# Altium schematic sheet Schematic_Rev1.SchDoc
size A4; SheetNumber: 1; SheetTotal: 1
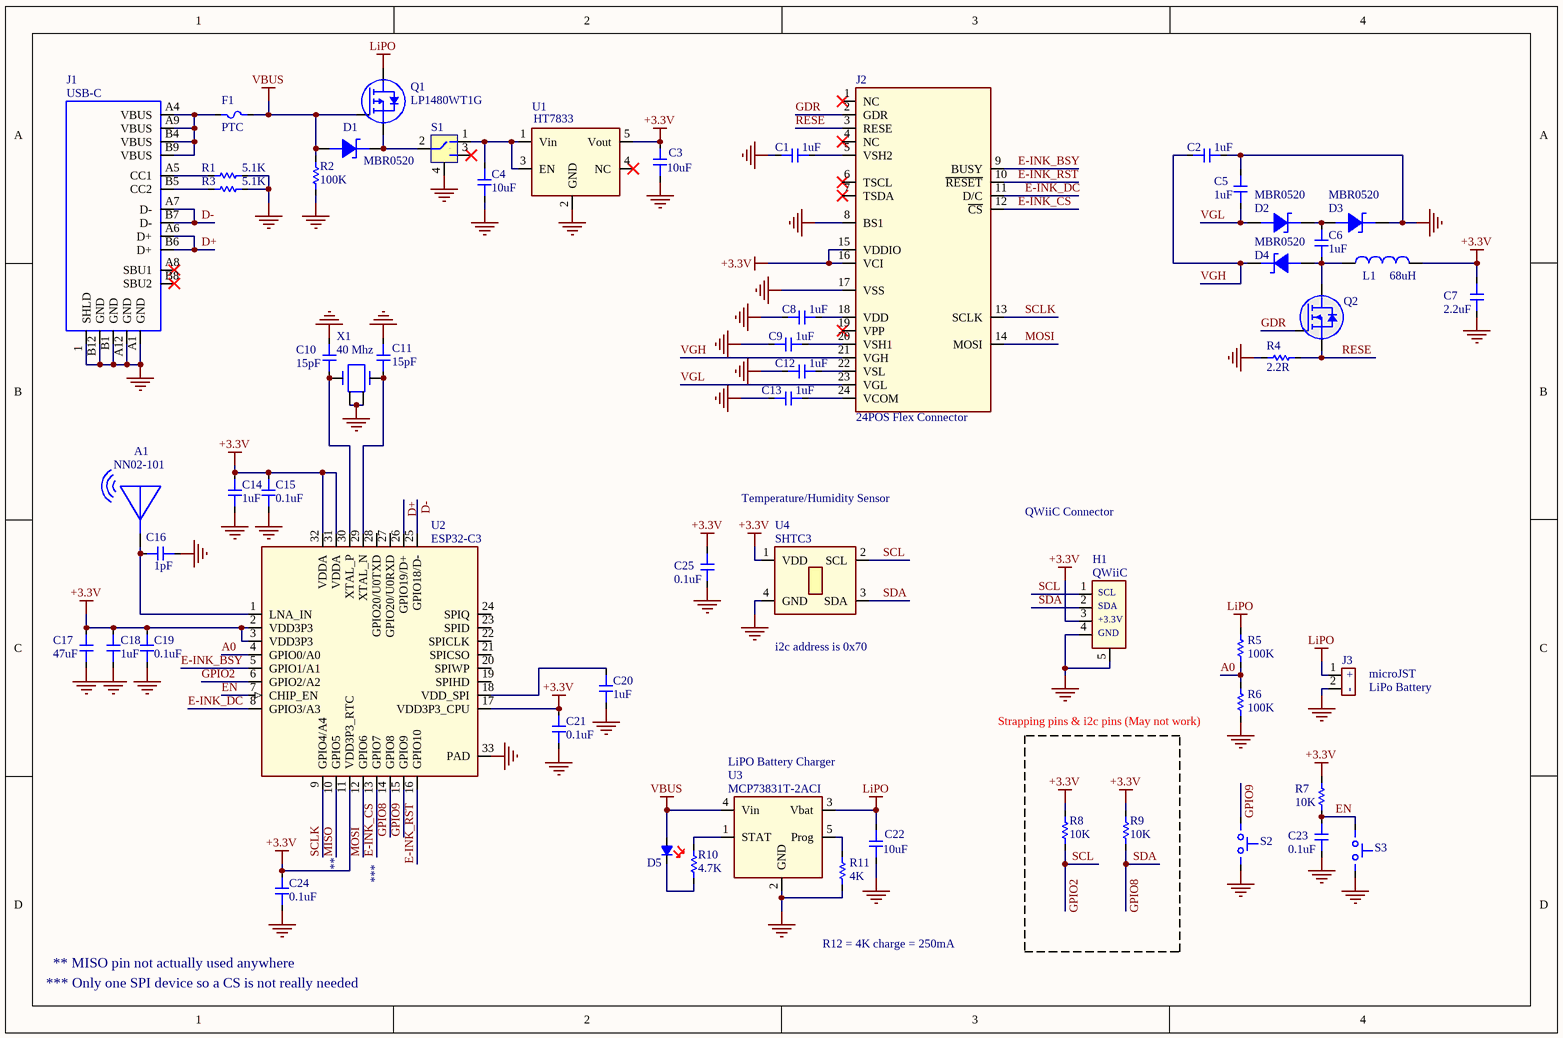
[diagram p0: Schematic_Rev1.SchDoc]

## Parts
A1  NN02-101  [NN02-101]
C1  1uF  [CAPC1005X56N]
C2  1uF  [CAPC1005X56N]
C3  10uF  [CAPC2012X140N]
C4  10uF  [CAPC2012X140N]
C5  1uF  [CAPC1005X56N]
C6  1uF  [CAPC1005X56N]
C7  2.2uF  [CAPC1608X09L]
C8  1uF  [CAPC1005X56N]
C9  1uF  [CAPC1005X56N]
C10  15pF  [CAPC1005X56N]
C11  15pF  [CAPC1005X56N]
C12  1uF  [CAPC1005X56N]
C13  1uF  [CAPC1005X56N]
C14  1uF  [CAPC1005X56N]
C15  0.1uF  [CAPC1005X56N]
C16  1pF  [CAPC1005X56N]
C17  47uF  [CAPC3225X160N]
C18  1uF  [CAPC1005X56N]
C19  0.1uF  [CAPC1005X56N]
C20  1uF  [CAPC1005X56N]
C21  0.1uF  [CAPC1005X56N]
C22  10uF  [CAPC2012X140N]
C23  0.1uF  [CAPC1005X56N]
C24  0.1uF  [CAPC1005X56N]
C25  0.1uF  [CAPC1005X56N]
D1  MBR0520  [SOD123]
D2  value MBR0520  [SOD123]  (hidden comment: MBR0520-TP)
D3  value MBR0520  [SOD123]  (hidden comment: MBR0520-TP)
D4  value MBR0520  [SOD123]  (hidden comment: MBR0520-TP)
D5  Red Led  [LED1005X40N-Red]  (value not drawn)
F1  TLC-PSMD050  [PTC2012X70L]  (value not drawn)
H1  QWiiC  [SM04B-SRSS-TB]
J1  USB-C  [TYPE-C-31-M-12]
J2  24POS Flex Connector  [687124182122]
J3  CON2  [JST_Micro_2PIN]  (value not drawn)  (no BOM)
L1  68uH  [INDUCTOR, 4mmX4mm]
Q1  LP1480WT1G  [SC-70]
Q2  (no value)  [SOT95P240X110-3N]
R1  5.1K  [RESC1005X40L (0402 FOOTPRINT)]
R2  100K  [RESC1005X40L (0402 FOOTPRINT)]
R3  5.1K  [RESC1005X40L (0402 FOOTPRINT)]
R4  2.2R  [RESC1005X40L (0402 FOOTPRINT)]
R5  100K  [RESC1005X40L (0402 FOOTPRINT)]
R6  100K  [RESC1005X40L (0402 FOOTPRINT)]
R7  10K  [RESC1005X40L (0402 FOOTPRINT)]
R8  10K  [RESC1005X40L (0402 FOOTPRINT)]
R9  10K  [RESC1005X40L (0402 FOOTPRINT)]
R10  4.7K  [RESC1005X40L (0402 FOOTPRINT)]
R11  4K  [RESC1005X40L (0402 FOOTPRINT)]
S1  SWITCH SLIDE  [K3-1296S-E1]  (value not drawn)
S2  (no value)  [TS-1088R-02526]
S3  (no value)  [TS-1088R-02526]
U1  HT7833  [SOT95P280X144-5N]
U2  ESP32-C3  [VFQFN-32 -ESP32-C3]
U3  value MCP73831T-2ACI  [SOT95P280X144-5N]  (hidden comment: MCP73831T-2ACI/OT)
U4  SHTC3  [DFN-4 (2.0mm X 2.0mm)]
X1  40 Mhz  [OSC20X16]

## Nets
+3.3V: C3.1 C7.1 C14.1 C15.1 C17.1 C18.1 C19.1 C21.1 C24.1 C25.1 H1.3 J2.15(VDDIO) J2.16(VCI) L1.2 R7.1 R8.2 R9.2 U1.5(Vout) U2.2(VDD3P3) U2.3(VDD3P3) U2.11(VDD3P3_RTC) U2.17(VDD3P3_CPU) U2.31(VDDA) U2.32(VDDA) U4.1(VDD)
GND: C1.1 C2.2 C3.2 C4.2 C5.1 C7.2 C8.1 C9.1 C10.1 C11.1 C12.1 C13.1 C14.2 C15.2 C16.2 C17.2 C18.2 C19.2 C20.2 C21.2 C22.2 C23.2 C24.2 C25.2 D3.1(Cathode) H1.4 H1.5 J1.1(SHLD) J1.A1(GND) J1.A12(GND) J1.B1(GND) J1.B12(GND) J2.8(BS1) J2.17(VSS) J3.2 R1.1 R2.2 R3.1 R4.2 R6.1 R11.1 S1.4 S2.2(B) S3.2(B) U1.2(GND) U2.33(PAD) U3.2(GND) U4.4(GND) X1.2 X1.4
LiPO: C22.1 J3.1 Q1.3(D) R5.2 U3.3(Vbat)
VBUS: D1.2(Annode) D5.2 F1.1 Q1.1(G) R2.1 U3.4(Vin)
A0: R5.1 R6.2 U2.4(GPIO0/A0)
D+: J1.A6(D+) J1.B6(D+) U2.26(GPIO19/D+)
D-: J1.A7(D-) J1.B7(D-) U2.25(GPIO18/D-)
E-INK_BSY: J2.9(BUSY) U2.5(GPIO1/A1)
E-INK_CS: J2.12(~{CS}) U2.13(GPIO7)
E-INK_DC: J2.11(D/C) U2.8(GPIO3/A3)
E-INK_RST: J2.10(~{RESET}) U2.16(GPIO10)
EN: C23.1 R7.2 S3.1(A) U2.7(CHIP_EN)
GDR: J2.2(GDR) Q2.1(G)
GPIO2: H1.1 R8.1 U2.6(GPIO2/A2) U4.2(SCL)  [also labelled SCL]
GPIO8: H1.2 R9.1 U2.14(GPIO8) U4.3(SDA)  [also labelled SDA]
GPIO9: S2.1(A) U2.15(GPIO9)
MISO: U2.10(GPIO5)
MOSI: J2.14(MOSI) U2.12(GPIO6)
RESE: J2.3(RESE) Q2.2(S) R4.1
SCLK: J2.13(SCLK) U2.9(GPIO4/A4)
VGH: C2.1 D4.1(Cathode) J2.21(VGH)
VGL: C5.2 D2.2(Annode) J2.23(VGL)
NetA1_1: A1.1 C16.1 U2.1(LNA_IN)
NetC1_2: C1.2 J2.5(VSH2)
NetC4_1: C4.1 S1.1 U1.1(Vin) U1.3(EN)
NetC6_1: C6.1 D2.1(Cathode) D3.2(Annode)
NetC6_2: C6.2 D4.2(Annode) L1.1 Q2.3(D)
NetC8_2: C8.2 J2.18(VDD)
NetC9_2: C9.2 J2.20(VSH1)
NetC10_2: C10.2 U2.30(XTAL_P) X1.1
NetC11_2: C11.2 U2.29(XTAL_N) X1.3
NetC12_2: C12.2 J2.22(VSL)
NetC13_2: C13.2 J2.24(VCOM)
NetC20_1: C20.1 U2.18(VDD_SPI)
NetD1_1: D1.1(Cathode) Q1.2(S) S1.2
NetD5_1: D5.1 R10.1
NetF1_2: F1.2 J1.A4(VBUS) J1.A9(VBUS) J1.B4(VBUS) J1.B9(VBUS)
NetJ1_A5: J1.A5(CC1) R1.2
NetJ1_B5: J1.B5(CC2) R3.2
NetR10_2: R10.2 U3.1(STAT)
NetR11_2: R11.2 U3.5(Prog)

Not connected (* = marked no-connect by the designer): J1 A8(SBU1)* B8(SBU2)*; J2 1(NC)* 4(NC)* 6(TSCL)* 7(TSDA)* 19(VPP)*; S1 3*; U1 4(NC)*; U2 19(SPIHD) 20(SPIWP) 21(SPICSO) 22(SPICLK) 23(SPID) 24(SPIQ) 27(GPIO20/U0RXD) 28(GPIO20/U0TXD)

## Notes on the sheet
- (near F1) PTC
- Temperature/Humidity Sensor
- QWiiC Connector
- (near U4) i2c address is 0x70
- (near J3) LiPo Battery
- (near J3) microJST
- (near U3) LiPO Battery Charger
- (near R6) Strapping pins & i2c pins (May not work)
- (near C24) **
- ***
- *** Only one SPI device so a CS is not really needed
- (near C24) ** MISO pin not actually used anywhere
- R12 = 4K charge = 250mA
- (in symbol JST_Micro_CONN_2PIN) +; -
- (in symbol SM04B-SRSS-TB) SCL; SDA; +3.3V; GND

## Library data of the parts
A1 = NN02-101: Antenna Chip 2.4Gig; Manufacturer: Ignion; Vendor: Digi-Key; Value: Chip Antenna; Part_Number: NN02-101
C1 C2 C5 C6 C8 C9 C12-C14 C18 C20 = CAP_0402: CAP 1uF 0402; Part_Footprint: 0402; Value: 1uF
C3 C4 C22 = CAP_0805: CAP 10uF 0805; Part_Footprint: 0805; Value: 10uF
C7 = CAP_0402: CAP 2.2uF 0603; Part_Footprint: 0603; Value: 2.2uF
C10 C11 = CAP_0402: CAP 15pF 0402; Part_Footprint: 0402; Value: 15pF
C15 C19 C21 C23-C25 = CAP_0402: CAP 0.1uF 0402; Part_Footprint: 0402; Value: 0.1uF
C16 = CAP_0402: CAP 1pF 0402; Part_Footprint: 0402; Value: 1pF
C17 = CAP_0402: CAP 47uF 1210; Part_Footprint: 1210; Value: 47uF
D1-D4 = MBR0520-TP: DIODE SCHOTTKY 20V 500MA SOD-123; Manufacturer: Micro; Part_Number: C78746; Vendor: LCSC; Part_Footprint: SOD-123
  D1: Value: MBR0520
D5 = LED_0402_SMALL_Red: LED Red 0402; Part_Number: C364556; Manufacturer: Lite-On; Part_Footprint: 0402; Vendor: LCSC; Value: Red Led
F1 = PTC_FUSE: PTC FUSE 500mA hold, 1A trip; Manufacturer: TLC; Part_Number: C261942; Vendor: LCSC; Value: TLC-PSMD050
H1 = SM04B-SRSS-TB: CONN HEADER 4POS .100 R/A QWIIC; Manufacturer: JST; Part_Number: PRT-14417; Vendor: Digi-Key; Value: QWiiC
J1 = USB-C: CONN RECPT USB-C; Manufacturer: KHE; Part_Number: C165948; Part_Footprint: SMT; Vendor: LCSC; Value: USB-C
J2 = 687124182122: CONN FFC TOP/BOT 24POS 0.50MM R/A; Manufacturer: Wurth; Vendor: Digi-Key; Part_Number: 687124182122; Value: 24POS Flex Connector
J3 = JST_Micro_CONN_2PIN: JST MIcro CONN 2POS
L1 = 68uH: INDUCTOR 68uH 20% 4mmx4mm; Part_Number: C135265; Manufacturer: SXN; Vendor: LCSC; Part_Footprint: 4mmx4mm; Value: 68uH
Q1 = LP1480WT1G: MOSFET P-CH 20V 1.4A SC-70; Manufacturer: LRC; Part_Number: C172434; Vendor: LCSC; Part_Footprint: SC-70; Value: LP1480WT1G
Q2 = 2N7002K-T1-E3: MOSFET N-CH 60V 300MA SOT-23; Manufacturer: Vishay Siliconix; Vendor: LCSC; Part_Footprint: SOT-23; Part_Number: 2N7002K-T1-E3
R1 R3 = RES_0402: RES 5.1K 0402; Part_Footprint: 0402; Value: 5.1K
R2 R5 R6 = RES_0402: RES 100K 0402; Part_Footprint: 0402; Value: 100K
R4 = RES_0402: RES 2.2R 0402; Part_Footprint: 0402; Value: 2.2R
R7-R9 = RES_0402: RES 10K 0402; Part_Footprint: 0402; Value: 10K
R10 = RES_0402: RES 4.7K 0402; Part_Footprint: 0402; Value: 4.7K
R11 = RES_0402: RES 4K 0402; Part_Footprint: 0402; Value: 4K
S1 = K3-1296S-E1: SWITCH SLIDE SMD; Manufacturer: Korean Hroparts Elec; Vendor: LCSC; Value: SWITCH SLIDE; Part_Number: K3-1296S-E1; Part_Footprint: *
S2 S3 = TS-1088R-02526: Tactile Micro Switch; Part_Number: C455281; Manufacturer: XUNPU; Part_Footprint: SMD; Vendor: LCSC
U1 = HT7833: IC LDO 3.3V 0.5A SOT23-5; Manufacturer: Holtek; Part_Number: C164106; Vendor: LCSC; Value: HT7833; Part_Footprint: SOT23-5
U2 = ESP32-C3: WIFI/Bluetooth, VFQFN-32; Manufacturer: Espressif; Part_Number: C529594; Part_Footprint: QFN56; Vendor: LCSC; Value: ESP32-C3
U3 = MCP73831T-2ACI/OT: Charger IC Lithium-Ion/Polymer SOT23-5; Manufacturer: Microchip; Vendor: Digi-Key; Part_Number: MCP73831T-2ACI/OT
U4 = SHTC3: Humidity/Temperature Sensor; Manufacturer: Sensirion; Vendor: LCSC; Value: Temp/Humid; Part_Number: SHTC3
X1 = 40Mhz: CRYSTAL 40MHZ 10PF SMD; Part_Number: ECS-400-10-37B2-CKM; Manufacturer: ECS; Vendor: Digi-Key; Value: 40 Mhz